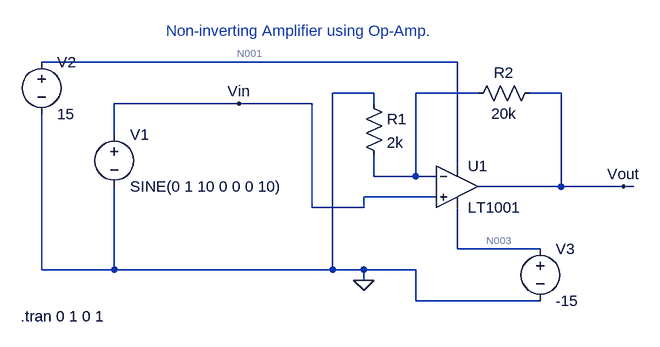
[diagram p0: schematic NonInvertingApmlifierUsingOpAmp.asc]
NonInvertingApmlifierUsingOpAmp.asc, the LTspice schematic file:
Version 4
SHEET 1 880 680
WIRE 160 -48 -480 -48
WIRE 32 0 -32 0
WIRE 192 0 96 0
WIRE 320 0 272 0
WIRE -176 16 -368 16
WIRE -64 16 -176 16
WIRE 32 16 32 0
WIRE -368 64 -368 16
WIRE 160 112 160 -48
WIRE 32 128 32 96
WIRE 96 128 96 0
WIRE 96 128 32 128
WIRE 128 128 96 128
WIRE 320 144 320 0
WIRE 320 144 192 144
WIRE 416 144 320 144
WIRE 432 144 416 144
WIRE 128 160 16 160
WIRE -64 176 -64 16
WIRE 16 176 16 160
WIRE 16 176 -64 176
WIRE 160 240 160 176
WIRE 288 240 160 240
WIRE -480 272 -480 32
WIRE -368 272 -368 144
WIRE -368 272 -480 272
WIRE -32 272 -32 0
WIRE -32 272 -368 272
WIRE 16 272 -32 272
WIRE 96 272 16 272
WIRE 16 288 16 272
WIRE 96 320 96 272
WIRE 288 320 96 320
FLAG 16 288 0
FLAG 416 144 Vout
FLAG -176 16 Vin
SYMBOL Opamps\\LT1001 160 80 R0
SYMATTR InstName U1
SYMBOL voltage -368 48 R0
WINDOW 123 0 0 Left 2
WINDOW 39 0 0 Left 2
SYMATTR InstName V1
SYMATTR Value SINE(0 1 10 0 0 0 10)
SYMBOL res 16 0 R0
SYMATTR InstName R1
SYMATTR Value 2k
SYMBOL res 288 -16 R90
WINDOW 0 0 56 VBottom 2
WINDOW 3 32 56 VTop 2
SYMATTR InstName R2
SYMATTR Value 20k
SYMBOL voltage -480 -64 R0
WINDOW 123 0 0 Left 2
WINDOW 39 0 0 Left 2
SYMATTR InstName V2
SYMATTR Value 15
SYMBOL voltage 288 224 R0
WINDOW 123 0 0 Left 2
WINDOW 39 0 0 Left 2
SYMATTR InstName V3
SYMATTR Value -15
TEXT -512 344 Left 2 !.tran 0 1 0 1
TEXT -288 -96 Left 2 ;Non-inverting Amplifier using Op-Amp.

The netlist it stands for:
* NonInvertingApmlifierUsingOpAmp.asc
XU1 Vin N002 N001 N003 Vout LT1001  ; pins In+ In- V+ V- OUT
V1 Vin 0 SINE(0 1 10 0 0 0 10)
R1 0 N002 2k
R2 Vout N002 20k
V2 N001 0 15
V3 N003 0 -15
.tran 0 1 0 1
* Non-inverting Amplifier using Op-Amp.
.lib LTC.lib
.backanno
.end

* Results of the author's LTspice run, read from the files saved beside the schematic
* Operating Point, zero values left out:
*   V(n001) = 15 V
*   V(n003) = -15 V
*   I(V3) = 2.25 mA
*   I(V2) = -2.25 mA
*   Ix(u1:3) = 2.25 mA
*   Ix(u1:4) = -2.25 mA
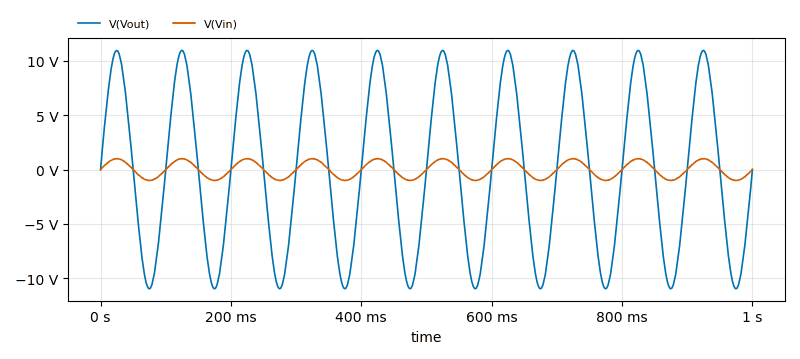
[diagram p1: Transient Analysis of NonInvertingApmlifierUsingOpAmp.asc, plotted from the saved traces]
* Transient Analysis, 1 run:
*   V(Vout): min -10.97 V, max 10.97 V, average 1.129 mV, rms 7.762 V, last -1.335 mV
*   V(Vin): min -999.9 mV, max 999.7 mV, average 64.27 µV, rms 718.5 mV, last 0 V